# Altium schematic sheet main.SchDoc
size A4; SheetNumber: 1; SheetTotal: 1
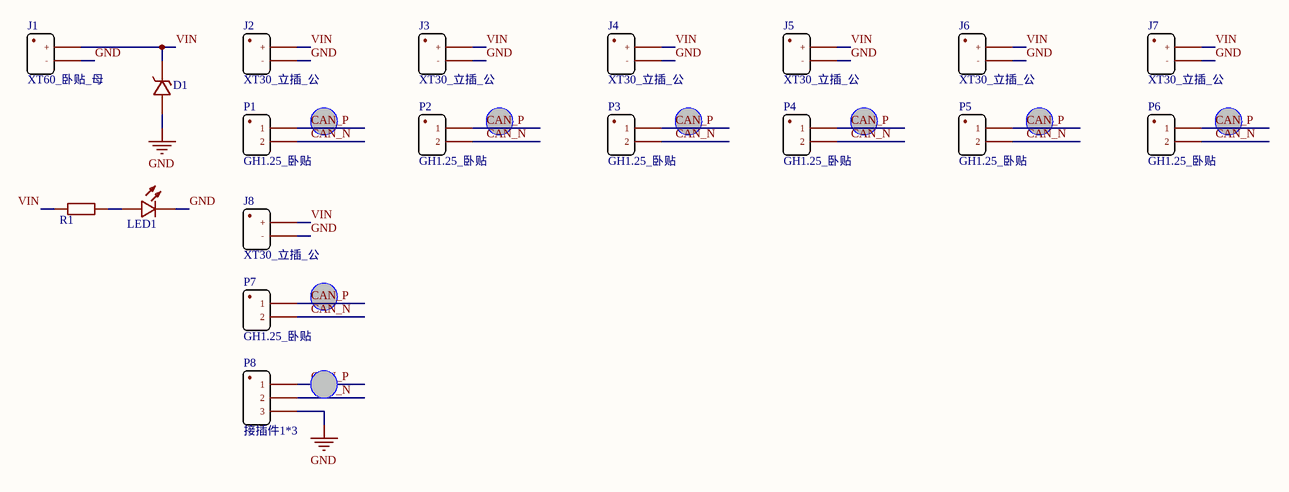
[diagram p0: main.SchDoc]

## Parts
D1  SMAJ24A  [SMA]  (value not drawn)
J1  XT60_卧贴_母  [XT60-PT-M]
J2  XT30_立插_公  [XT30-UPB-F]
J3  XT30_立插_公  [XT30-UPB-F]
J4  XT30_立插_公  [XT30-UPB-F]
J5  XT30_立插_公  [XT30-UPB-F]
J6  XT30_立插_公  [XT30-UPB-F]
J7  XT30_立插_公  [XT30-UPB-F]
J8  XT30_立插_公  [XT30-UPB-F]
LED1  LED  [0603D]  (value not drawn)
P1  GH1.25_卧贴  [GH1.25-PW-1*2]
P2  GH1.25_卧贴  [GH1.25-PW-1*2]
P3  GH1.25_卧贴  [GH1.25-PW-1*2]
P4  GH1.25_卧贴  [GH1.25-PW-1*2]
P5  GH1.25_卧贴  [GH1.25-PW-1*2]
P6  GH1.25_卧贴  [GH1.25-PW-1*2]
P7  GH1.25_卧贴  [GH1.25-PW-1*2]
P8  接插件1*3  [GH1.25-PW-1*3]
R1  10K  [0603R]  (value not drawn)

## Nets
GND: D1.1 J1.2 J2.2 J3.2 J4.2 J5.2 J6.2 J7.2 J8.2 LED1.2 P8.3
CAN_N: P1.2 P2.2 P3.2 P4.2 P5.2 P6.2 P7.2 P8.2
CAN_P: P1.1 P2.1 P3.1 P4.1 P5.1 P6.1 P7.1 P8.1
VIN: D1.2 J1.1 J2.1 J3.1 J4.1 J5.1 J6.1 J7.1 J8.1 R1.1
NetLED1_1: LED1.1 R1.2

## Notes on the sheet
- (in symbol 接口_XT) +; -

## Library data of the parts
D1 = 二极管_瞬态抑制
J1-J8 = 接口_XT
LED1 = 二极管_贴片发光
P1-P7 = 接插件1*2
R1 = 电阻_贴片